# Altium project USBC_Power_Supply.PrjPcb (part 2 of 2)

## Sheet Logic_Level_Output.SchDoc
size A; SheetNumber: 6; SheetTotal: 8
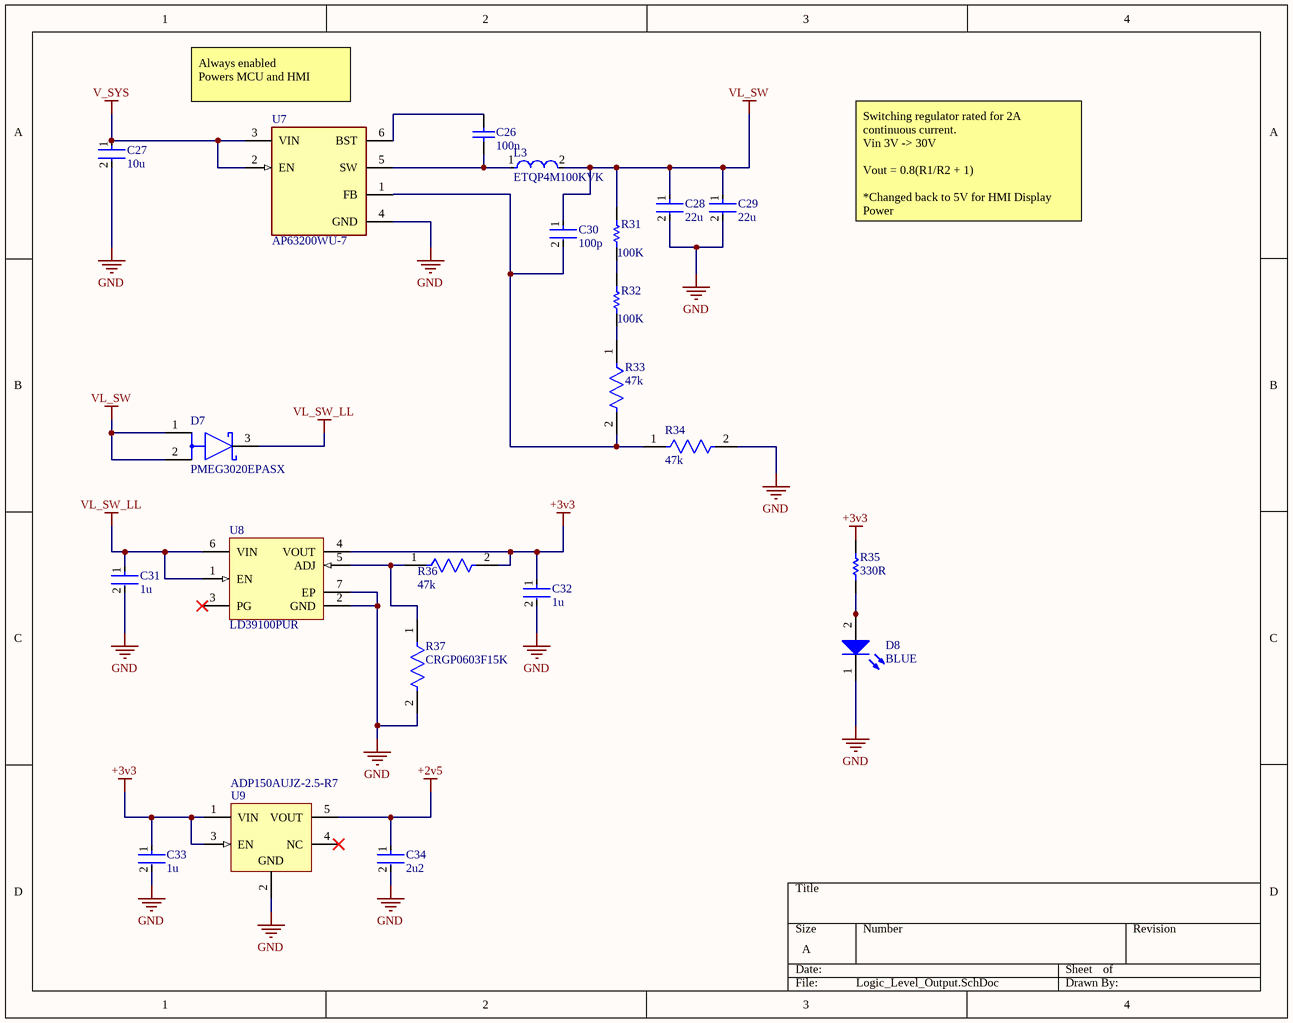
[diagram p5: Logic_Level_Output.SchDoc]

### Parts
C26  100n  [CAPC1608X90X35NL15T15]
C27  10u  [FP-C0805X106K8RACAUTO-MFG]
C28  22u  [FP-C0805C226M8PACTU-MFG]
C29  22u  [FP-C0805C226M8PACTU-MFG]
C30  100p  [FP-C0603C-CF-MFG]
C31  1u  [FP-0603-L_1_6_0_15-W_0_81-IPC_A]
C32  1u  [FP-0603-L_1_6_0_15-W_0_81-IPC_A]
C33  1u  [FP-0603-L_1_6_0_15-W_0_81-IPC_A]
C34  2u2  [FP-CC0603-DC-MFG]
D7  PMEG3020EPASX  [FP-SOT1061D-MFG]
D8  BLUE  [WL-SMCW_0603_150060xx75000]
L3  ETQP4M100KVK  [FP-PCC-M0840M-LP-MFG]
R31  100K  [RESC0603(1608)_N]
R32  100K  [RESC0603(1608)_N]
R33  47k  [FP-AT0603-MFG]
R34  47k  [FP-AT0603-MFG]
R35  330R  [RESC1608X55X25NL10T15]
R36  47k  [FP-AT0603-MFG]
R37  CRGP0603F15K  [FP-CRGP0603-IPC_C]
U7  AP63200WU-7  [FP-TSOT26-MFG]
U8  LD39100PUR  [DFN6D_M]
U9  ADP150AUJZ-2.5-R7  [ADI-UJ-5_N]

### Nets
+2v5: C34.1 U9.5(VOUT)
+3v3: C32.1 C33.1 R35.2 R36.2 U8.4(VOUT) U9.1(VIN) U9.3(EN)
GND: C27.2 C28.2 C29.2 C31.2 C32.2 C33.2 C34.2 D8.1(K) R34.2 R37.2 U7.4(GND) U8.2(GND) U8.7(EP) U9.2(GND)
V_SYS: C27.1 U7.2(EN) U7.3(VIN)
VL_SW: C28.1 C29.1 C30.1 D7.1(A) D7.2(A) L3.2 R31.2
VL_SW_LL: C31.1 D7.3(C) U8.1(EN) U8.6(VIN)
NetC26_1: C26.1 L3.1 U7.5(SW)
NetC26_2: C26.2 U7.6(BST)
NetC30_2: C30.2 R33.2 R34.1 U7.1(FB)
NetD8_2: D8.2(A) R35.1
NetR31_1: R31.1 R32.2
NetR32_1: R32.1 R33.1
NetR36_1: R36.1 R37.1 U8.5(ADJ)

Not connected (* = marked no-connect by the designer): U8 3(PG)*; U9 4(NC)*

### Notes on the sheet
- (near U7) Always enabled
  Powers MCU and HMI
- Switching regulator rated for 2A continuous current.
  Vin 3V -> 30V
  Vout = 0.8(R1/R2 + 1)
  *Changed back to 5V for HMI Display Power

### Library data of the parts
C26 = CMP-2006-02299-1: Part Number: C0603C104K4RAC7013; Manufacturer: Kemet
C27 = CMP-03020-034694-1: CAP CER 10UF 10V X7R 0805; Tolerance: 10%; Case/Package: 0805; Min Operating Temperature: -55°C; Max Operating Temperature: 125°C; RoHS Compliant: Yes; Ratings: AEC-Q200; Mount: Surface Mount; Features: Soft Termination; Capacitance: 10uF; Packaging: Cut Tape; Case Code (Metric): 2012; Voltage Rating: 10V; Case Code (Imperial): 0805
C28 C29 = CMP-03020-034697-1: CAP CER 22UF 10V X5R 0805; Tolerance: 20%; Dissipation Factor: 10%; Dielectric Material: Ceramic; Termination: Solder; Case Code (Imperial): 0805; Packaging: Tape and Reel; Height: 1.25mm; Voltage: 10V; Case Code (Metric): 2012; Case/Package: 0805; Width: 0.049inch; Capacitance: 22uF; Length: 0.079inch; Depth: 1.25mm; RoHS Compliant: Yes; Voltage Rating (DC): 10V; Lead Free: Lead Free; Dielectric: X5R; Thickness: 0.055inch; Mount: Surface Mount; Voltage Rating: 10V; Max Operating Temperature: 85°C; Min Operating Temperature: -55°C
C30 = CMP-03020-026556-1: CAP CER 100PF 10V X7R 0603; Manufacturer: KEMET; Manufacturer Part Number: C0603C101K8RAC7867; Material: Ceramic; Temperature Coefficient: 30ppm/°C; Automotive Grade: Grade 1; Tolerance: 0.1; RoHS: TRUE; Lead Free: Yes; Octopart: https://octopart.com/c0603c101k8rac7867-kemet-83501928; Device Class L1: Passive Components; ComponentLink2URL: https://api.kemet.com/component-edge/download/datasheet/C0603C100J5GACAUTO.pdf; Value: 100 pF; Digikey Description: CAP CER 100PF 10V X7R 0603; Package: C0603C-CF; Voltage Rating: 10 V; Height: 0.87mm; Temperature: -55°C to +125°C; Temperature Range High: +125°C; Device Class L3: Ceramic Capacitors; Capacitance: 100 pF; ComponentLink2Description: Datasheet; Temperature Range Low: -55°C; Category: Cap; Temperature Characteristic: X7R; Device Class L2: Capacitors; Automotive: Yes
C31-C33 = CMP-2006-04474-2: General Purpose Ceramic Capacitor, 0603, 1uF, 10%, X5R, 15%, 6.3V; Insulation Resistance: 100GR; Dissipation Factor: 5%; Package Quantity: 1; Mount: Surface Mount; Series: -; Number of Pins: 2; Length: 1.6mm; RoHS Compliant: Yes; Capacitance: 1uF; Depth: 0.81mm; Case Code (Imperial): 0603; Lead Free: Lead Free; Max Operating Temperature: 85°C; Case Code (Metric): 1608; Min Operating Temperature: -55°C; Contact Plating: Tin; Voltage: 6.3V; Tolerance: 10%; Width: 0.032inch; Voltage Rating (DC): 6.3V; Voltage Rating: 6.3V; Termination: SMD/SMT; Radiation Hardening: No; Case/Package: 0603; Thickness: 0.035inch; Height: 0.9mm; REACH SVHC: No SVHC; Packaging: Tape and Reel; Construction: Flat; Dielectric: X5R
C34 = CMP-03422-000578-2: CAP CER 2.2UF 50V X5R 0603; Tolerance: 10%; Packaging: Cut Tape; Capacitance: 2.2uF; Min Operating Temperature: -55°C; RoHS Compliant: Yes; Max Operating Temperature: 85°C; Case Code (Metric): 1608; Voltage Rating: 50V; Case/Package: 0603; Case Code (Imperial): 0603; Mount: Surface Mount
D7 = CMP-14398-000019-1: DIODE SCHOTTKY 30V 2A SOT1061
D8 = CMP-1426-00003-4: Led, Blue, 470 Nm, 3.2 V, 30 Ma, 145 Mcd Rohs Compliant: Yes; Peak Wavelength: 465nm; Dominant Wavelength: 470nm; Power Dissipation: 105mW; Viewing Angle: 140°; Test Current: 20mA; Max Junction Temperature (Tj): 95°C; Forward Current: 100mA; Reverse Voltage: 5V; Luminous Intensity: 145mcd; Lens Style: Clear, Rectangular; Forward Voltage: 3.2V; RoHS: Compliant; Min Operating Temperature: -40°C; REACH SVHC: Unknown; Max Operating Temperature: 85°C; Width: 800µm; Case Code (Imperial): 0603; Case Code (Metric): 1608; Max Reverse Voltage (DC): 5V; Height: 700µm; Case/Package: 0603; Mount: Surface Mount; Packaging: Tape and Reel; Color: Blue; Wavelength: 470nm; Length: 1.6mm
L3 = CMP-05439-000002-1: FIXED IND 10UH 5.2A 45.76 MOHM; Manufacturer: Panasonic; Saturation Current: 9.1A; Automotive Grade: Grade 0; Shielding: true; Series Resistance: 45.76mΩ; Test Frequency: 100kHz; Rms Current: 4.4A; Core Material: Metal Composite; Tolerance: 20%; Standoff Height: 0.05mm; Device Class L2: Inductors; ComponentLink2URL: https://industrial.panasonic.com/cdbs/www-data/pdf/AGL0000/AGL0000C63.pdf; Value: 10uH; Lead Free: Yes; Octopart: https://octopart.com/etqp4m100kvk-panasonic-71577993; RoHS: TRUE; Digikey Description: FIXED IND 10UH 5.2A 45.76 MOHM; Device Class L1: Passive Components; Temperature Range Low: -55°C; Temperature Range High: +155°C; Height: 4mm; Automotive: Yes; Category: Ind; Manufacturer Part Number: ETQP4M100KVK; Inductance: 10uH; Device Class L3: Fixed Inductors; Package: PCC-M0840M-LP; Temperature: -55°C to +155°C; ComponentLink2Description: Datasheet
R31 R32 = CMP-1012-00736-1: 100K 0.1W 1% 0603 (1608 Metric)  SMD; Value: 100000.00 Ohm; Case-Metric: 1608; Case-EIA: 0603; Power: 0.1 W; Tolerance: 1 %; Technology: SMT
R33 R34 R36 = CMP-03412-020972-2: Thin Film Chip Resistors Automotive Grade 47kΩ 1% 50ppm/°C 0603; Max Power Dissipation: 100mW; Resistance: 47kR; Series: AT; Case/Package: 0603; Temperature Coefficient: 50ppm/°C; Length: 0.063inch; Number of Terminations: 2; Width: 0.032inch; Tolerance: 1%; Min Operating Temperature: -55°C; Features: Moisture Resistant; Resistor Type: Thin Film; RoHS Compliant: Yes; Case Code (Imperial): 0603; Packaging: Cut Tape; Height: 0.022inch; Ratings: AEC-Q200; Case Code (Metric): 1608; Max Operating Temperature: 155°C
R35 = CMP-1659-00020-2: Chip Resistor, 330 Ohm, +/- 1%, 0.1 W, -55 to 155 degC, 0603 (1608 Metric), RoHS, Tape and Reel; Tolerance: 10%; ESR: 800 mohm; Voltage Rating (DC): 16 V; Capacitance: 47 uF; Length: 7.3 mm; ComponentLink1URL: http://www.yageo.com/; Packaging: Tape and Reel; Pins: 2; ComponentLink1Description: Manufacturer URL; Case Code (Imperial): 2917; REACH SVHC: No SVHC; Width: 4.3 mm; ComponentLink2Description: Datasheet; Voltage Rating: 16 V; RoHSCompliant: True; Max Operating Temperature: 125degC; ComponentLink2URL: http://www.yageo.com/documents/recent/PYu-RC_Group_51_RoHS_L_04.pdf; Min Operating Temperature: -55degC; Case/Package: 2917; Radiation Hardening: No; DatasheetVersion: Rev. 4, 02/2016; Mount: Surface Mount; PackageReference: 0603; Package Quantity: 500; Case Code (Metric): 7343; PackageDescription: 2-Pin Surface Mount Device, Body 1.6 x 0.8 mm; Height: 3.1 mm
R37 = CMP-03211-008902-1: CRGP0603 15KΩ 0.25W ±100ppm/°C 1% 50V; Manufacturer: TE; Tolerance: 0.01; Device Class L2: Resistors; ComponentLink2URL: https://www.te.com/commerce/DocumentDelivery/DDEController?Action=srchrtrv&DocNm=9-1773463-9&DocType=DS&DocLang=English; Composition: Thick Film; Device Class L3: Chip SMD Resistors; Manufacturer Part Number: CRGP0603F15K; Power Rating: 0.25W; Ambient Temperature Range High: +70°C; Package: CRGP0603; Device Class L1: Passive Components; Value: 15KΩ; Temperature Range Low: -55°C; Resistance: 15KΩ; Temperature Range High: +155°C; Voltage Rating: 50V; Category: Res; Octopart: https://octopart.com/crgp0603f15k-te+connectivity-91018729; Ipc Land Pattern Name: RESC16080X45; Series: CRGP; ComponentLink2Description: Datasheet; Height: 0.55mm; RoHS: TRUE; Temperature Coefficient: ±100ppm/°C; Automotive: No; Temperature: -55°C to +155°C; Lead Free: Yes
U7 = CMP-12757-000010-1: IC REG BUCK ADJUSTABLE 2A TSOT26; Manufacturer: Diodes Inc.; Switching Frequency: 500kHz; Max Supply Voltage: 32V; Number Of Outputs: 1; Nominal Supply Current: 22uA; Min Supply Voltage: 3.8V; Output Type: AdjustableProgrammable; Max Junction Temp: +160°C; Standoff Height: 0.01mm; Octopart: https://octopart.com/ap63200wu-7-diodes+inc.-98099548; Height: 1mm; Temperature Range Low: -40°C; Output Current: 2A; ComponentLink2URL: https://www.diodes.com/assets/Datasheets/AP63200-AP63201-AP63203-AP63205.pdf; Switching Topology: Buck; Automotive: No; Device Class L1: Integrated Circuits (ICs); Ipc Land Pattern Name: SOT95P280X100-6; Package: TSOT26; Temperature Range High: +85°C; RoHS: TRUE; Ambient Temperature Range High: +85°C; Device Class L3: Voltage Regulators - Switching; Temperature: -40°C to +85°C; Device Class L2: Power Management ICs; Footprint Url: https://www.diodes.com/assets/Package-Files/TSOT26.pdf; Mouser Description: AP63200 Series 1.2 V 2 A Adjustable Synchronous Buck Converter - TSOT-26; Category: IC; ComponentLink2Description: Datasheet; Digikey Description: IC REG BUCK ADJUSTABLE 2A TSOT26; Lead Free: Yes; Ambient Temperature Range Low: -40°C; Manufacturer Part Number: AP63200WU-7
U8 = CMP-0244-00287-1: 1 A Low Quiescent Current Low Noise Voltage Regulator, Adjustable from 0.8V, 6-Pin VFDFPN, Tape and Reel; ComponentLink1URL: http://www.st.com; ComponentLink1Description: Manufacturer URL; ComponentLink2Description: Datasheet; DatasheetVersion: 1/10/2011; PackageDescription: 6-Pin Plastic, Dual LLP, 3 x 3 mm Body, 0.95 mm Pitch, Exposed Pad; PackageReference: DFN6D; ComponentLink2URL: http://www.st.com/internet/com/TECHNICAL_RESOURCES/TECHNICAL_LITERATURE/DATASHEET/CD00233788.pdf; PackageVersion: 2008
U9 = CMP-0786-00375-1: Ultralow Noise, 150 mA CMOS Linear Regulator, 2.2 to 5.5 V Vin, 2.5 V Vout, Industrial, 5-pin SOT23 (UJ-5), Reel; Manufacturer: Analog Devices; Iout max: 150mA; Preset Vout Values (V): 2.5; Supply Current IGND @ Small Load: 10uA; Vin (max) (V): 5.5; Vin (min) (V): 2.2; ComponentLink1URL: http://www.analog.com/en/index.html; ComponentLink2Description: Datasheet; ComponentLink4URL: Product URL:http://www.analog.com/en/ADP150/productSearch.html; ComponentLink3Description: Package Specification; PackageDescription: 5-Pin Thin Small Outline Transistor Package, Body 2.9 x 1.6 mm, Pitch 0.95 mm; PackageReference: UJ-5; ComponentLink3URL: http:/www.analog.com/static/imported-files/packages/PKG_PDF/TSOT(UJ)/UJ_5.pdf; Packing: Reel; ComponentLink4Description: URL Link1; ComponentLink2URL: http://www.analog.com/static/imported-files/data_sheets/ADP150.pdf; Code_JEDEC: MO-193-AB; DatasheetVersion: Rev. A; PackageVersion: 100708-A, 10/2008; ComponentLink1Description: Manufacturer URL; Mounting Technology: Surface Mount; PartNumber: ADP150AUJZ-2.5-R7

## Sheet External_Connectors.SchDoc
size A; SheetNumber: 7; SheetTotal: 8
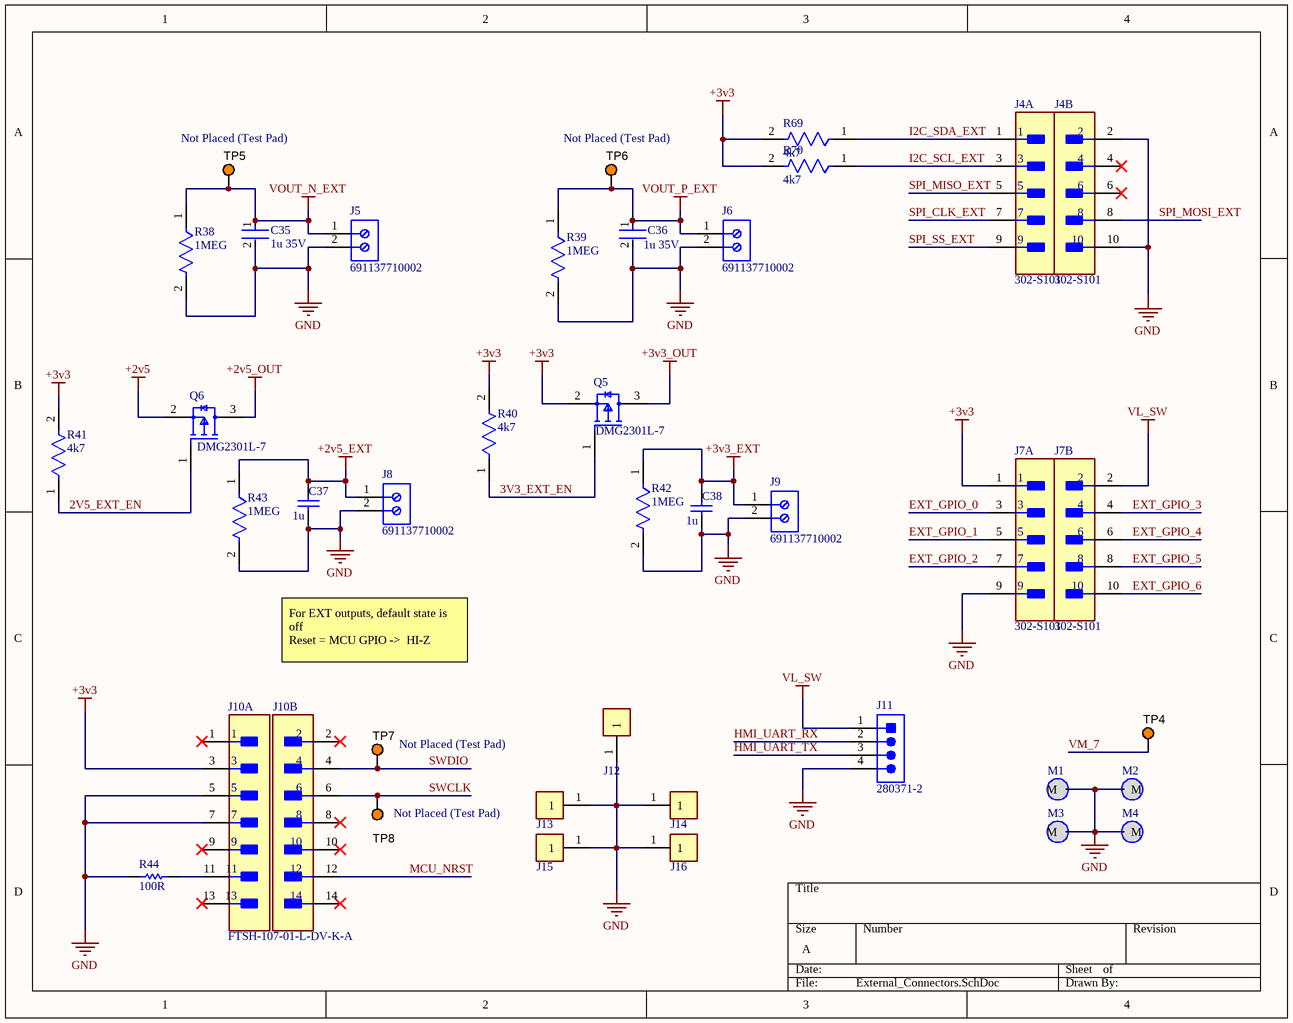
[diagram p6: External_Connectors.SchDoc]

### Parts
C35  1u 35V  [FP-CL10-IPC_C]
C36  1u 35V  [FP-CL10-IPC_C]
C37  1u  [CAPC2013X145X50NL20T25]
C38  1u  [CAPC2013X145X50NL20T25]
J4  302-S101  [FP-302-S101-MFG]  (parts A,B of 2)
J5  691137710002  [691137710002]
J6  691137710002  [691137710002]
J7  302-S101  [FP-302-S101-MFG]  (parts A,B of 2)
J8  691137710002  [691137710002]
J9  691137710002  [691137710002]
J10  FTSH-107-01-L-DV-K-A  [FP-FTSH-107-01-L-DV-K-A-MFG]  (parts A,B of 2)
J11  280371-2  [TECO-280371-2_V]
J12  5001  [FP-5001-MFG]  (value not drawn)
J13  5001  [FP-5001-MFG]  (value not drawn)
J14  5001  [FP-5001-MFG]  (value not drawn)
J15  5001  [FP-5001-MFG]  (value not drawn)
J16  5001  [FP-5001-MFG]  (value not drawn)
M1  Mounting_Holes  [Mountiing_Hole]  (value not drawn)
M2  Mounting_Holes  [Mountiing_Hole]  (value not drawn)
M3  Mounting_Holes  [Mountiing_Hole]  (value not drawn)
M4  Mounting_Holes  [Mountiing_Hole]  (value not drawn)
Q5  DMG2301L-7  [FP-SOT23-MFG]
Q6  DMG2301L-7  [FP-SOT23-MFG]
R38  1MEG  [FP-AC0603-IPC_A]
R39  1MEG  [FP-AC0603-IPC_A]
R40  4k7  [FP-AC0603-IPC_A]
R41  4k7  [FP-AC0603-IPC_A]
R42  1MEG  [FP-AC0603-IPC_A]
R43  1MEG  [FP-AC0603-IPC_A]
R44  100R  [RESC1608X55X30NL15T15]
R69  4k7  [FP-AC0603-IPC_A]
R70  4k7  [FP-AC0603-IPC_A]
TP4  5003  [KSTN-5003]  (value not drawn)
TP5  5003  [KSTN-5003]  (value not drawn)  (no BOM)
TP6  5003  [KSTN-5003]  (value not drawn)  (no BOM)
TP7  5003  [KSTN-5003]  (value not drawn)  (no BOM)
TP8  5003  [KSTN-5003]  (value not drawn)  (no BOM)

### Nets
+2v5: Q6.2(S)
+2v5_EXT: C37.2 J8.1 R43.1
+2v5_OUT: Q6.3(D)
+3v3: J7.1 J10.3 Q5.2(S) R40.2 R41.2 R69.2 R70.2
+3v3_EXT: C38.2 J9.1 R42.1
+3v3_OUT: Q5.3(D)
GND: C35.2 C36.2 C37.1 C38.1 J4.2 J4.10 J5.2 J6.2 J7.9 J8.2 J9.2 J10.5 J10.7 J11.4 J12.1 J13.1 J14.1 J15.1 J16.1 M1.M M2.M M3.M M4.M R38.2 R39.2 R42.2 R43.2 R44.2
VL_SW: J7.2 J11.1
VOUT_N_EXT: C35.1 J5.1 R38.1 TP5.1  [project net RS-]
VOUT_P_EXT: C36.1 J6.1 R39.1 TP6.1
2V5_EXT_EN: Q6.1(G) R41.1
3V3_EXT_EN: Q5.1(G) R40.1
EXT_GPIO_0: J7.3
EXT_GPIO_1: J7.5
EXT_GPIO_2: J7.7
EXT_GPIO_3: J7.4
EXT_GPIO_4: J7.6
EXT_GPIO_5: J7.8
EXT_GPIO_6: J7.10
HMI_UART_RX: J11.2
HMI_UART_TX: J11.3
I2C_SCL_EXT: J4.3 R70.1
I2C_SDA_EXT: J4.1 R69.1
MCU_NRST: J10.12
SPI_CLK_EXT: J4.7
SPI_MISO_EXT: J4.5
SPI_MOSI_EXT: J4.8
SPI_SS_EXT: J4.9
SWCLK: J10.6 TP8.1
SWDIO: J10.4 TP7.1
VM_7: TP4.1
NetJ10_11: J10.11 R44.1

Not connected (* = marked no-connect by the designer): J4 4* 6*; J10 1* 2* 8* 9* 10* 13* 14*

### Notes on the sheet
- (near TP5) Not Placed (Test Pad)
- (near TP6) Not Placed (Test Pad)
- For EXT outputs, default state is off
  Reset = MCU GPIO ->  HI-Z
- (near TP7) Not Placed (Test Pad)
- (near TP8) Not Placed (Test Pad)

### Library data of the parts
C35 C36 = CMP-13271-002885-1: Cap Ceramic 1uF 35V X5R ±10% Pad SMD 0603 +85°C T/R; Dielectric: X5R; Tolerance: 10%; Packaging: Tape and Reel; Contact Plating: Tin; Case/Package: 0603; Length: 0.063inch; Case Code (Metric): 1608; Voltage Rating (DC): 35V; Capacitance: 1uF; Package Quantity: 1; Thickness: 0.035inch; Voltage Rating: 35V; Width: 0.031inch; Min Operating Temperature: -55°C; Case Code (Imperial): 0603; Termination: Wraparound; Lead Free: Lead Free; Max Operating Temperature: 85°C; Mount: Surface Mount
C37 C38 = CMP-2007-01213-1: Part Number: C0805C106M9RACTU; Manufacturer: Kemet
J4 J7 = CMP-15228-000002-1: CONN HEADER VERT 10POS 2.54MM; Voltage Rating: 250V; Row Spacing: 0.1inch; Number of Positions: 10; Mount: Through Hole; Series: 302; Contact Type: Male Pin; Contact Plating: Gold; Contact Material: Brass; Number of Rows: 2; Color: Black; Contact Finish - Mating: GOLD; Packaging: Bulk; Pitch: 0.1inch; Fastening Type: Pull; Insulation Color: Black; Termination: Solder; Flammability Rating: UL94 V-0; Connector Type: Header; Max Operating Temperature: 105°C; Insulation Material: Glass; Contact Shape: Square; Min Operating Temperature: -40°C
J5 J6 J8 J9 = CMP-1502-03324-2: NexarPartId: 78871135; Voltage Rating: 300V; Number of Contacts: 2; Current Rating: 16A; Lead Pitch: 5mm; Height: 11.6mm; Packaging: Box; RoHS: Non-Compliant; Contact Material: Nickel, Tin; Max Operating Temperature: 120°C; Number of Pins: 2; Min Operating Temperature: -30°C; Number of Rows: 1
J10 = CMP-02766-001414-1: CONN HEADER SMD 14POS 1.27MM; Number of Contacts: 14; Gender: Male; Contact Plating: Gold; Termination: Solder; Lead Free: Lead Free; Contact Material: Bronze; Pitch: 1.27mm; Number of Rows: 2; RoHS Compliant: Yes
J11 = CMP-2000-05548-1: Male Header, Pitch 2.54 mm, 1 x 4 Position, Height 12.8 mm, Tail Length 3.5 mm, -55 to 105 degC, RoHS, Bulk; Manufacturer: TE Connectivity; Pitch: 0.100"(2.54mm); Connector Type: Header,Shrouded; Other Names: 280371-2-ND / A106401; Number of Positions Loaded: All; Dynamic Catalog: AMPMODUModIISeries; Number of Positions: 4; 3D Model: 280371-2.pdf; Termination: Solder; Package Description: Male Header, Pitch 2.54 mm, 1 x 4 Position, Height 12.8 mm, Tail Length 3.5 mm; Datasheet Version: Rev. M1, 08/2016; Contact Mating Length: 0.260"(6.60mm); Datasheet URL: http://www.te.com/commerce/DocumentDelivery/DDEController?Action=showdoc&DocId=Customer+Drawing%7F280370%7FM1%7Fpdf%7FEnglish%7FENG_CD_280370_M1.pdf%7F280371-2; Mounting Technology: ThroughHole; Standard Package: 1,000; Contact Finish Thickness: 15µin(0.38µm); Contact Finish: Gold; Contact Type: MalePin; Packaging: Bulk; Mounting Type: ThroughHole; Number of Rows: 1; Family: RectangularConnectors-Headers,MalePins; Manufacturer URL: http://www.te.com/; Color: Black; RoHS Information: 280371-2StatementofCompliance; Package Reference: 280371-2; Category: Connectors,Interconnects; Series: AMPMODUModII
J12-J16 = CMP-2000-05181-2: PC TEST POINT MINIATURE BLACK; Body Material: Bronze; Plating: Silver; Inside Diameter: 1.27mm; Hole Diameter: 1.6mm; Number of Ports: 1; Outside Diameter: 2.54mm; Insulation: Insulated; Insulation Material: Nylon; Mount: Through Hole; RoHS Compliant: Yes; Series: THM; Height: 0.3inch; Termination: Through Hole; Material: Nylon; Packaging: Bulk; Contact Material: Bronze; REACH SVHC: No SVHC; Contact Plating: Silver; Orientation: Straight; Lead Free: Lead Free; Package Quantity: 100; Length: 7.62mm; Flammability Rating: UL94 V-0; Number of Contacts: 1; Diameter: 2.54mm; Housing Color: Black; Color: Black
Q5 Q6 = CMP-12801-000065-1: MOSFET P-CH 20V 3A SOT23; Manufacturer: Diodes Inc.; Number Of Channels: 1; Turn On Delay Time: 5ns; Drain To Source Resistance: 120mΩ; Max Junction Temp: +150°C; Gate To Source Voltage: 8V; Power Dissipation: 1.5W; Rthja Max: 83°C/W; Max Forward Diode Voltage: -1.2V; Standoff Height: 0.013mm; Threshold Vgs Min: -0.4V; Input Capacitace At Vds: 476pF @ -10V; Depletion Mode: False; Gate Charge At Vgs: 5.5nC @ -4.5V; Pulse Drain Current: -10A; Drain To Source Voltage: -20V; Continuous Drain Current: -3A; Turn Off Delay Time: 30ns; Lead Free: Yes; Package: SOT23; ComponentLink2Description: Datasheet; Device Class L3: MOSFETs; Device Class L1: Discrete Semiconductors; Manufacturer Part Number: DMG2301L-7; Automotive: No; Height: 1.1mm; Category: Trans; Temperature Range High: +150°C; Digikey Description: MOSFET P-CH 20V 3A SOT23; RoHS: TRUE; Number Of P Channels: 1; Footprint Url: https://www.diodes.com/assets/Package-Files/SOT23.pdf; Octopart: https://octopart.com/dmg2301l-7-diodes+inc.-67250456; ComponentLink2URL: https://www.diodes.com/assets/Datasheets/DMG2301L.pdf; Mouser Description: Single P-Channel 20 V 1.5 W 5.5 nC Silicon Surface Mount Mosfet - SOT-23; Drain To Source Breakdown Voltage: -20V; Threshold Vgs Max: -1.2V; Device Class L2: Transistors; Temperature: -55°C to +150°C; Temperature Range Low: -55°C
R38 R39 R42 R43 = CMP-03412-042588-1: RES 1MΩ 1.00% 0.1W 0603; Tolerance: 1%; Resistance: 1MR; RoHS Compliant: Yes; Case/Package: 0603
R40 R41 R69 R70 = CMP-03412-006483-2: RES 4.7KΩ 1.00% 0.1W 0603; Tolerance: 1%; Resistance: 4.7kR; Case/Package: 0603; RoHS Compliant: Yes
R44 = CMP-2000-00258-1: Part Number: ERJ-3EKF1502V; Manufacturer: Panasonic
TP4-TP8 = CMP-1672-00009-1: Test Point, Orange, 1-Pin THD, RoHS; Peak Reverse Current: 600 uA; Forward Current: 3 A; Max Surge Current: 80 A; Forward Voltage: 1.08 V; Max Operating Temperature: 150 degC; PackageReference: 5003; Pins: 2; ComponentLink2URL: http://keyelco.com/userAssets/file/M65p56.pdf; PackageDescription: 1-Pin Through Hole Device, Dia 2.54 mm; Weight: 0.01 lb; Diameter: 5.3 mm; Mount: Through Hole; Package Quantity: 500; Packaging: Bulk; Min Operating Temperature: -65 degC; ComponentLink1Description: Manufacturer URL; Height: 0.25 inch; ComponentLink1URL: http://www.keyelco.com/; ComponentLink2Description: Datasheet; Width: 0.25 inch; REACH SVHC: No SVHC; RoHSCompliant: true; Radiation Hardening: No; Length: 9.5 mm; DatasheetVersion: Jun-15

## Sheet Measurements.SchDoc
size A; SheetNumber: 8; SheetTotal: 8
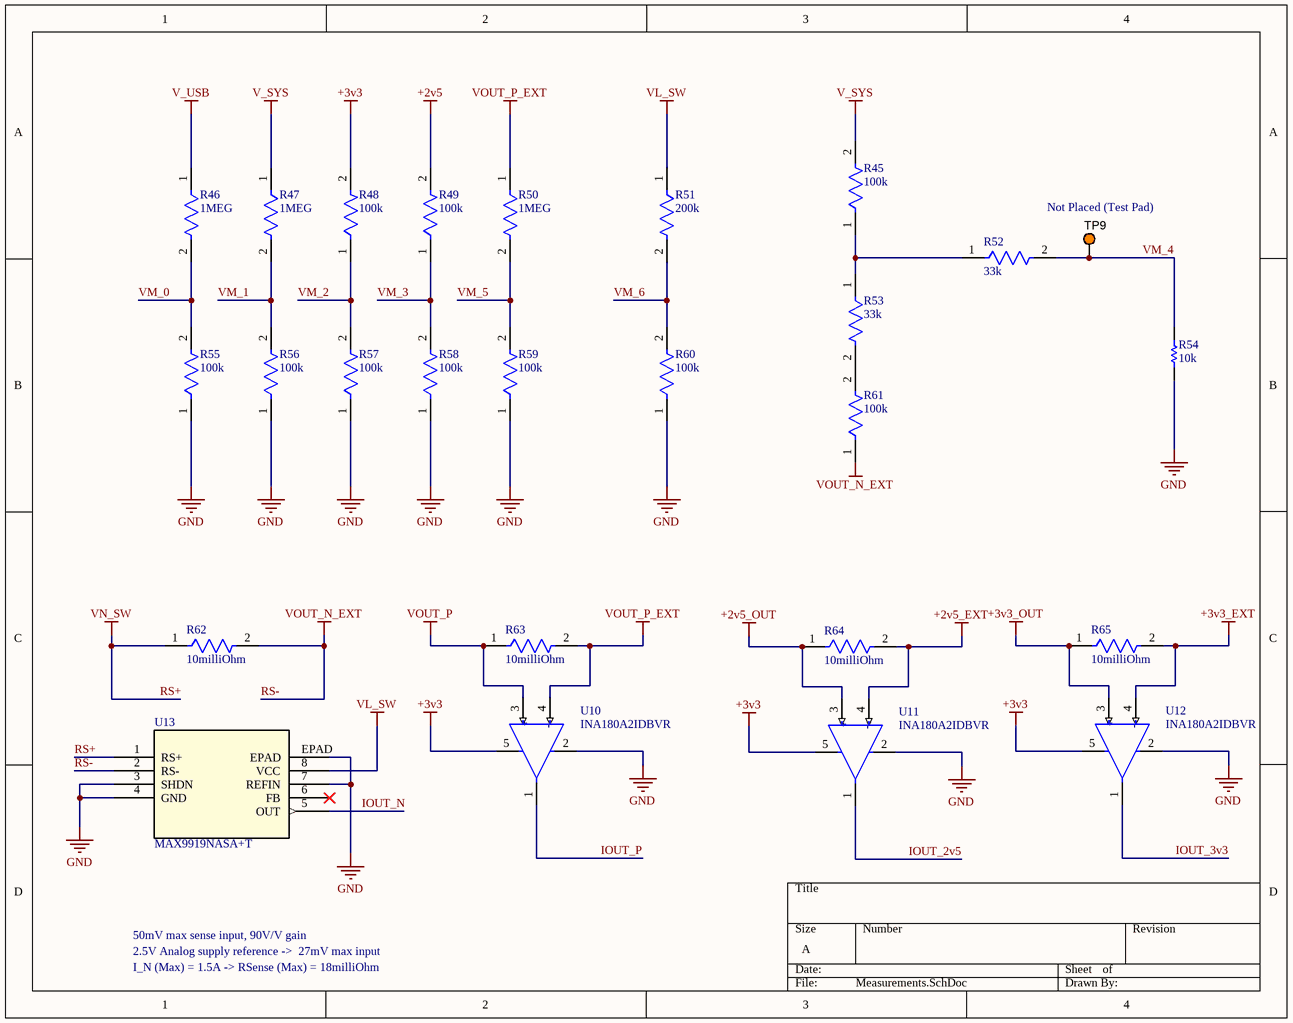
[diagram p7: Measurements.SchDoc]

### Parts
R45  100k  [FP-AC0603-IPC_A]
R46  1MEG  [FP-AC0603-IPC_A]
R47  1MEG  [FP-AC0603-IPC_A]
R48  100k  [FP-AC0603-IPC_A]
R49  100k  [FP-AC0603-IPC_A]
R50  1MEG  [FP-AC0603-IPC_A]
R51  200k  [FP-RMCF0603-IPC_A]
R52  33k  [FP-CRGCQ0603-IPC_C]
R53  33k  [FP-CRGCQ0603-IPC_C]
R54  10k  [RESC1608X55X30NL15T15]
R55  100k  [FP-AC0603-IPC_A]
R56  100k  [FP-AC0603-IPC_A]
R57  100k  [FP-AC0603-IPC_A]
R58  100k  [FP-AC0603-IPC_A]
R59  100k  [FP-AC0603-IPC_A]
R60  100k  [FP-AC0603-IPC_A]
R61  100k  [FP-AC0603-IPC_A]
R62  10milliOhm  [FP-CSRF0603-high-IPC_A]
R63  10milliOhm  [FP-CSRF0603-high-IPC_A]
R64  10milliOhm  [FP-CSRF0603-high-IPC_A]
R65  10milliOhm  [FP-CSRF0603-high-IPC_A]
TP9  5003  [KSTN-5003]  (value not drawn)  (no BOM)
U10  INA180A2IDBVR  [FP-DBV0005A-MFG]
U11  INA180A2IDBVR  [FP-DBV0005A-MFG]
U12  INA180A2IDBVR  [FP-DBV0005A-MFG]
U13  MAX9919NASA+T  [21-0111D_S8E-14_MXM]

### Nets
+2v5: R49.2
+2v5_EXT: R64.2 U11.4(IN-)
+2v5_OUT: R64.1 U11.3(IN+)
+3v3: R48.2 U10.5(VS) U11.5(VS) U12.5(VS)
+3v3_EXT: R65.2 U12.4(IN-)
+3v3_OUT: R65.1 U12.3(IN+)
GND: R54.1 R55.1 R56.1 R57.1 R58.1 R59.1 R60.1 U10.2(GND) U11.2(GND) U12.2(GND) U13.3(SHDN) U13.4(GND) U13.7(REFIN) U13.EPAD
RS+: R62.1 U13.1(RS+)  [also labelled VN_SW]
RS-: R61.1 R62.2 U13.2(RS-)  [also labelled VOUT_N_EXT]
V_SYS: R45.2 R47.1
V_USB: R46.1
VL_SW: R51.1 U13.8(VCC)
VOUT_P: R63.1 U10.3(IN+)
VOUT_P_EXT: R50.1 R63.2 U10.4(IN-)
IOUT_2v5: U11.1(OUT)
IOUT_3v3: U12.1(OUT)
IOUT_N: U13.5(OUT)
IOUT_P: U10.1(OUT)
VM_0: R46.2 R55.2
VM_1: R47.2 R56.2
VM_2: R48.1 R57.2
VM_3: R49.1 R58.2
VM_4: R52.2 R54.2 TP9.1
VM_5: R50.2 R59.2
VM_6: R51.2 R60.2
NetR45_1: R45.1 R52.1 R53.1
NetR53_2: R53.2 R61.2

Not connected (* = marked no-connect by the designer): U13 6(FB)*

### Notes on the sheet
- Not Placed (Test Pad)
- 50mV max sense input, 90V/V gain
- 2.5V Analog supply reference ->  27mV max input
- I_N (Max) = 1.5A -> RSense (Max) = 18milliOhm
- (in symbol CMP-04895-000287-1) +; -

### Library data of the parts
R45 R48 R49 R55-R61 = CMP-03412-043770-1: RES 100kΩ 1.00% 0.2W 0603
R46 R47 R50 = CMP-03412-042588-1: as R38 on sheet External_Connectors; RoHS Compliant: Yes; Case/Package: 0603
R51 = CMP-26527-006122-1: 200kΩ ±1% 0.1W 0603 Thick Film Chip Resistor AEC-Q200 compliant; Resistance: 200kR; Max Power Dissipation: 100mW; Temperature Coefficient: 100ppm/°C; Series: RMCF; Case/Package: 0603; Width: 0.031inch; Features: Automotive AEC-Q200; Contact Plating: Tin; RoHS Compliant: Yes; Resistor Type: Thick Film; Min Operating Temperature: -55°C; Mount: Surface Mount; Height: 0.022inch; Packaging: Tape and Reel; Tolerance: 1%; Number of Terminations: 2; Radiation Hardening: No; Length: 0.061inch; Max Operating Temperature: 155°C
R52 R53 = CMP-03211-001378-1: CRGCQ0603 33KΩ 5% ±100ppm/°C 75V; Manufacturer Part Number: CRGCQ0603J33K; Manufacturer: TE Connectivity; Tolerance: 0.05; Power Rating: 0.1W; Temperature Range Low: -55°C; ComponentLink2URL: https://www.te.com/commerce/DocumentDelivery/DDEController?Action=showdoc&DocId=Data+Sheet%7F1773204-3%7F1%7Fpdf%7FEnglish%7FENG_DS_1773204-3_1.pdf%7F4-2176339-1037; Device Class L3: Chip SMD Resistors; Device Class L1: Passive Components; Temperature Coefficient: ±100ppm/°C; Temperature Range High: +155°C; Series: CRGCQ; Category: Res; Ambient Temperature Range High: +70°C; Temperature: -55°C to +155°C; RoHS: TRUE; Resistance: 33KΩ; Ipc Land Pattern Name: RESC16080X45; Octopart: https://octopart.com/crgcq0603j33k-te+connectivity-91018119; Lead Free: Yes; Height: 0.55mm; Device Class L2: Resistors; Composition: Thick Film; ComponentLink2Description: Datasheet; Value: 33KΩ; Voltage Rating: 75V; Package: CRGCQ0603
R54 = CMP-2000-00258-1: as R44 on sheet External_Connectors
R62-R65 = CMP-26527-001905-1: RES 0.01 OHM 1% 1/4W 0603; Resistance: 10mR; Max Power Dissipation: 250mW; Temperature Coefficient: 75ppm/°C; Tolerance: 1%; Lead Free: Lead Free; Series: CSRF; Max Operating Temperature: 170°C; Number of Terminations: 2; Packaging: Tape and Reel; RoHS Compliant: Yes; Military Standard: Not; Resistor Type: Metal Foil; Length: 0.063inch; Width: 0.031inch; Case Code (Imperial): 0603; Case/Package: 0603; Depth: 0.8mm; Case Code (Metric): 1608; Features: Moisture Resistant; Min Operating Temperature: -55°C; Mount: Surface Mount; Construction: Rectangular; Height: 0.03inch
TP9 = CMP-1672-00009-1: as TP4 on sheet External_Connectors; Max Operating Temperature: 150 degC; PackageReference: 5003; Pins: 2; ComponentLink2URL: http://keyelco.com/userAssets/file/M65p56.pdf; PackageDescription: 1-Pin Through Hole Device, Dia 2.54 mm; Weight: 0.01 lb; Diameter: 5.3 mm; Mount: Through Hole; Package Quantity: 500; Packaging: Bulk; Min Operating Temperature: -65 degC; ComponentLink1Description: Manufacturer URL; Height: 0.25 inch; ComponentLink1URL: http://www.keyelco.com/; ComponentLink2Description: Datasheet; Width: 0.25 inch; REACH SVHC: No SVHC; RoHSCompliant: true; Radiation Hardening: No; Length: 9.5 mm; DatasheetVersion: Jun-15
U10-U12 = CMP-04895-000287-1: IC CURR SENSE 1 CIRCUIT SOT23-5; Operating Supply Current: 260uA; -3db Bandwidth: 350kHz; Slew Rate: 2V/µs; Number of Circuits: 1; Input Offset Voltage (Vos): 100uV; Input Bias Current: 100nA; Mount: Surface Mount; Max Operating Temperature: 125°C; Packaging: Tape and Reel; Min Operating Temperature: -40°C; Case/Package: SOT-23-5; RoHS Compliant: Yes
U13 = MAX9919NASA+T: -20V to +75V Input Range, Precision Uni-/Bidirectional, Current-Sense Amplifiers; Manufacturer_Name: Analog Devices / Maxim Integrated; Copyright: Copyright (C) 2026 Ultra Librarian. All rights reserved.; Manufacturer_Part_Number: MAX9919NASA+T; RefDes: RefDes; Type: Type

## Nets that join several sheets
+2v5: MCU (U2.28), Logic_Level_Output (C34.1 U9.5), External_Connectors (Q6.2), Measurements (R49.2)
+2v5_EXT: External_Connectors (C37.2 J8.1 R43.1), Measurements (R64.2 U11.4)
+2v5_OUT: External_Connectors (Q6.3), Measurements (R64.1 U11.3)
+3v3: MCU (24 pins), Positive_Output (U4.2), Negative_Output (R25.2 U6.8), Logic_Level_Output (7 pins), External_Connectors (7 pins), Measurements (R48.2 U10.5 U11.5 U12.5)
+3v3_EXT: External_Connectors (C38.2 J9.1 R42.1), Measurements (R65.2 U12.4)
+3v3_OUT: External_Connectors (Q5.3), Measurements (R65.1 U12.3)
GND: USBC_PD_Controller (12 pins), USB_C_Connectors (14 pins), MCU (17 pins), Positive_Output (9 pins), Negative_Output (9 pins), Logic_Level_Output (14 pins), External_Connectors (28 pins), Measurements (14 pins)
RS+: Negative_Output (6 pins), Measurements (R62.1 U13.1)
RS-: External_Connectors (C35.1 J5.1 R38.1 TP5.1), Measurements (R61.1 R62.2 U13.2)
V_SYS: USBC_PD_Controller (8 pins), Positive_Output (C18.1 C19.1 U3.3), Negative_Output (Q3.2 R28.2), Logic_Level_Output (C27.1 U7.2 U7.3), Measurements (R45.2 R47.1)
V_USB: USBC_PD_Controller (5 pins), USB_C_Connectors (J3.2 TP2.1), Measurements (R46.1)
VL_SW: Negative_Output (U6.6), Logic_Level_Output (7 pins), External_Connectors (J7.2 J11.1), Measurements (R51.1 U13.8)
VOUT_P: Positive_Output (5 pins), Measurements (R63.1 U10.3)
VOUT_P_EXT: External_Connectors (C36.1 J6.1 R39.1 TP6.1), Measurements (R50.1 R63.2 U10.4)
2V5_EXT_EN: MCU (U2.2), External_Connectors (Q6.1 R41.1)
3V3_EXT_EN: MCU (U2.3), External_Connectors (Q5.1 R40.1)
ALERT_N: USBC_PD_Controller (U1.19), MCU (R12.1 U2.18)
CC1: USBC_PD_Controller (U1.1 U1.2), USB_C_Connectors (J1.A5)
CC2: USBC_PD_Controller (U1.4 U1.5), USB_C_Connectors (J1.B5)
EXT_GPIO_0: MCU (U2.19), External_Connectors (J7.3)
EXT_GPIO_1: MCU (U2.20), External_Connectors (J7.5)
EXT_GPIO_2: MCU (U2.21), External_Connectors (J7.7)
EXT_GPIO_3: MCU (U2.26), External_Connectors (J7.4)
EXT_GPIO_4: MCU (U2.62), External_Connectors (J7.6)
EXT_GPIO_5: MCU (U2.22), External_Connectors (J7.8)
EXT_GPIO_6: MCU (U2.59), External_Connectors (J7.10)
HMI_UART_RX: MCU (U2.57), External_Connectors (J11.2)
HMI_UART_TX: MCU (U2.56), External_Connectors (J11.3)
I2C_SCL_EXT: MCU (U2.41), External_Connectors (J4.3 R70.1)
I2C_SDA_EXT: MCU (U2.40), External_Connectors (J4.1 R69.1)
IOUT_2v5: MCU (U2.34), Measurements (U11.1)
IOUT_3v3: MCU (U2.36), Measurements (U12.1)
IOUT_N: MCU (U2.17), Measurements (U13.5)
IOUT_P: MCU (U2.25), Measurements (U10.1)
MCU_NRST: MCU (C13.2 SW2.1 SW2.2 U2.7), External_Connectors (J10.12)
NDAC_CLK: MCU (U2.52), Negative_Output (U6.11)
NDAC_DIN: MCU (U2.54), Negative_Output (U6.10)
NDAC_RDY: MCU (U2.58), Negative_Output (U6.14)
NDAC_SDO: MCU (U2.53), Negative_Output (U6.13)
NDAC_SYNC: MCU (U2.55), Negative_Output (U6.12)
PD_SCL: USBC_PD_Controller (U1.7), MCU (R15.1 U2.51)
PD_SDA: USBC_PD_Controller (U1.8), MCU (R16.1 U2.60)
RESET: USBC_PD_Controller (R6.1 U1.6), MCU (U2.24)
SPI_CLK_EXT: MCU (U2.6), External_Connectors (J4.7)
SPI_MISO_EXT: MCU (U2.44), External_Connectors (J4.5)
SPI_MOSI_EXT: MCU (U2.37), External_Connectors (J4.8)
SPI_SS_EXT: MCU (U2.30), External_Connectors (J4.9)
SWCLK: MCU (U2.50), External_Connectors (J10.6 TP8.1)
SWDIO: MCU (U2.49), External_Connectors (J10.4 TP7.1)
USBD_N: USB_C_Connectors (J2.A7 J2.B7), MCU (U2.45)
USBD_P: USB_C_Connectors (J2.A6 J2.B6), MCU (U2.46)
VM_0: MCU (U2.5), Measurements (R46.2 R55.2)
VM_1: MCU (U2.8), Measurements (R47.2 R56.2)
VM_2: MCU (U2.9), Measurements (R48.1 R57.2)
VM_3: MCU (U2.10), Measurements (R49.1 R58.2)
VM_4: MCU (U2.11), Measurements (R52.2 R54.2 TP9.1)
VM_5: MCU (U2.12), Measurements (R50.2 R59.2)
VM_6: MCU (U2.13), Measurements (R51.2 R60.2)
VM_7: MCU (U2.14), External_Connectors (TP4.1)
VN_ENABLE: MCU (U2.4), Negative_Output (R29.2)
VP_Enable: MCU (U2.23), Positive_Output (R24.2 U3.5)
VP_SCL: MCU (R14.1 U2.43), Positive_Output (U4.4)
VP_SDA: MCU (R13.1 U2.42), Positive_Output (U4.5)